# EAGLE design stepper_ctrl_v2 (EAGLE 6.5.0)
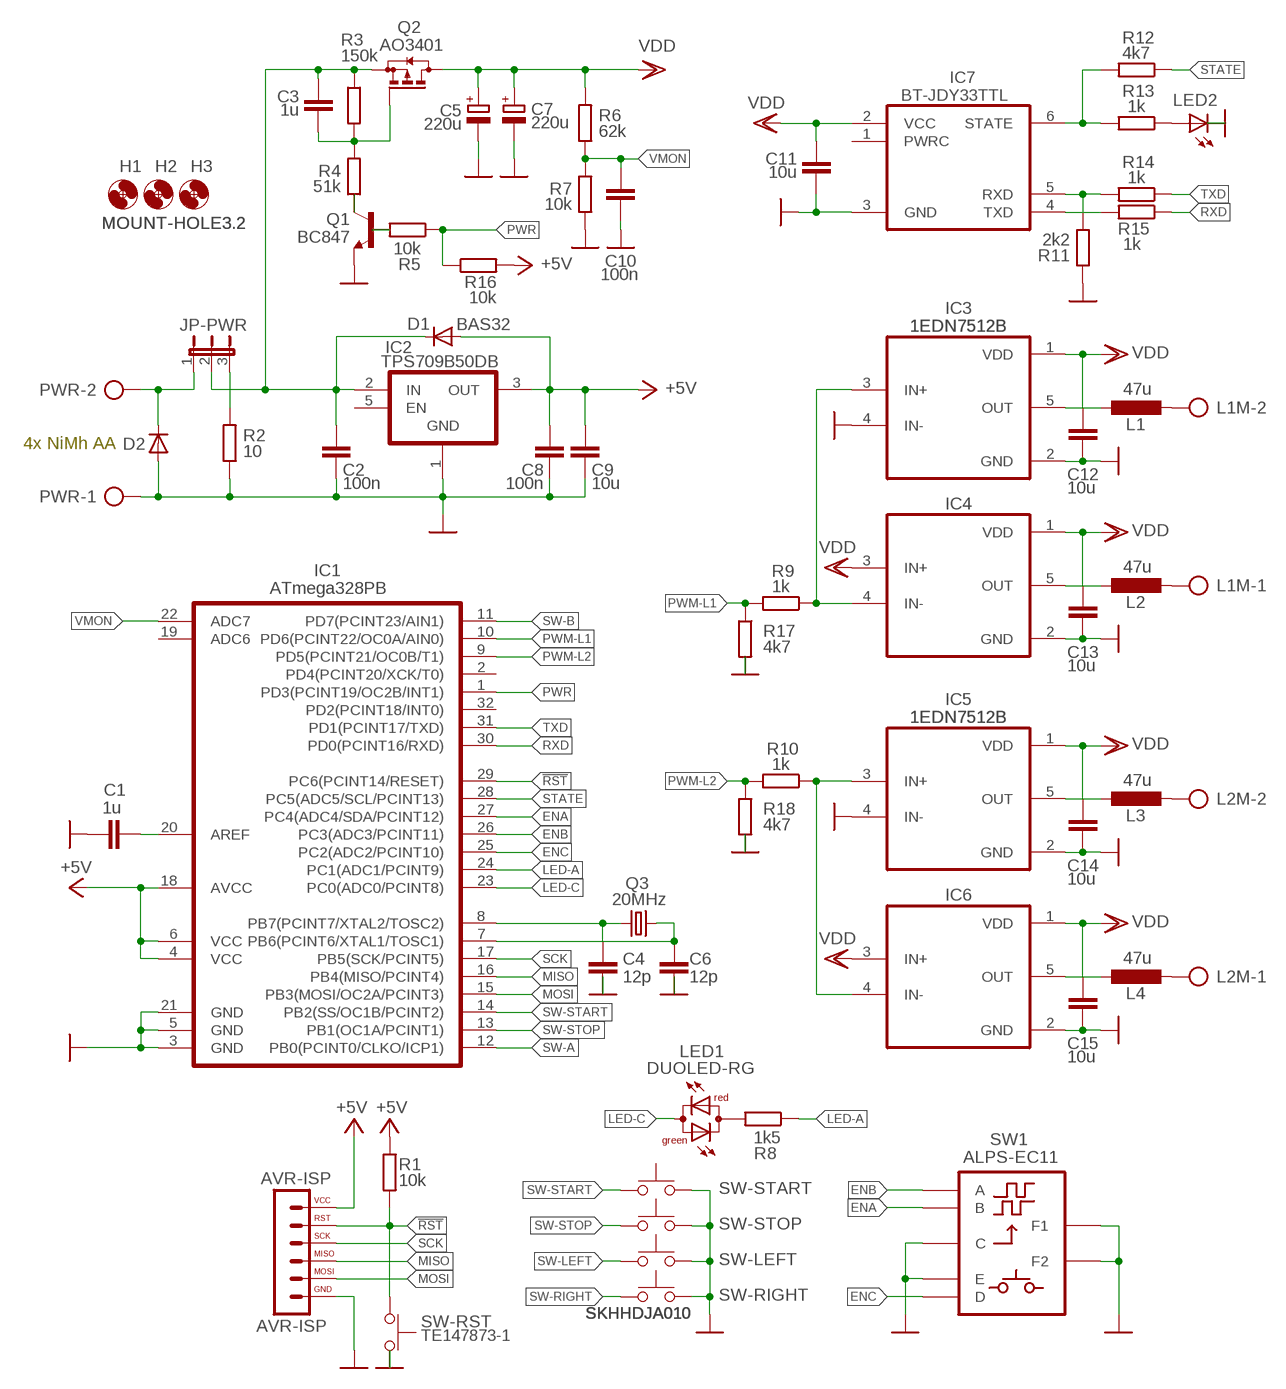
[diagram p0: schematic, sheet 1]

## Parts
AVR-ISP  AVR-ISP  AVR_SPINR  [SIL6-NNRND]
C1  1u  C-EUC0805K  [C0805K]
C2  100n  C-EUC0805K  [C0805K]
C3  1u  C-EUC0805K  [C0805K]
C4  12p  C-EUC0603K  [C0603K]
C5  220u  CPOL-EUE2.5-6  [E2,5-6]
C6  12p  C-EUC0603K  [C0603K]
C7  220u  CPOL-EUE2.5-6  [E2,5-6]
C8  100n  C-EUC0805K  [C0805K]
C9  10u  C-EUC0805K  [C0805K]
C10  100n  C-EUC0603K  [C0603K]
C11  10u  C-EUC0805K  [C0805K]
C12  10u  C-EUC0805K  [C0805K]
C13  10u  C-EUC0805K  [C0805K]
C14  10u  C-EUC0805K  [C0805K]
C15  10u  C-EUC0805K  [C0805K]
D1  BAS32  [SOD80C]
D2  DIODE-SMB  [SMB]
H1  MOUNT-HOLE3.2  [3,2]
H2  MOUNT-HOLE3.2  [3,2]
H3  MOUNT-HOLE3.2  [3,2]
IC1  ATmega328PB  ATMEGA88T  [TQFP32]
IC2  TPS709B50DB  TPS709B50DB-  [SOT23-5]
IC3  1EDN7512B  [SOT23-5]
IC4  1EDN7512B  [SOT23-5]
IC5  1EDN7512B  [SOT23-5]
IC6  1EDN7512B  [SOT23-5]
IC7  BT-JDY33TTL  [BT-JFY33TTL]
JP-PWR  JP2EB  [JP2YB]
L1  47u  L-EUL4018  [L4018]
L1M  AK500/2  [AK500/2]
L2  47u  L-EUL4018  [L4018]
L2M  AK500/2  [AK500/2]
L3  47u  L-EUL4018  [L4018]
L4  47u  L-EUL4018  [L4018]
LED1  DUOLED-RG  [LED3MM]
LED2  LED3MM  [LED3MM]
PWR  AK500/2  [AK500/2]
Q1  BC847  BC847CLT1SMD  [SOT23]
Q2  AO3401  BSS84  [SOT23]
Q3  20MHz  CRYSTALHC49U-V  [HC49U-V]
R1  10k  R-EU_R0603  [R0603]
R2  10  R-EU_R0805  [R0805]
R3  150k  R-EU_R0603  [R0603]
R4  51k  R-EU_R0603  [R0603]
R5  10k  R-EU_R0603  [R0603]
R6  62k  R-EU_R0603  [R0603]
R7  10k  R-EU_R0603  [R0603]
R8  1k5  R-EU_R0603  [R0603]
R9  1k  R-EU_R0603  [R0603]
R10  1k  R-EU_R0603  [R0603]
R11  2k2  R-EU_R0603  [R0603]
R12  4k7  R-EU_R0603  [R0603]
R13  1k  R-EU_R0603  [R0603]
R14  1k  R-EU_R0603  [R0603]
R15  1k  R-EU_R0603  [R0603]
R16  10k  R-EU_R0603  [R0603]
R17  4k7  R-EU_R0603  [R0603]
R18  4k7  R-EU_R0603  [R0603]
SW1  ALPS-EC11  ALPS_EC11  [ALPS_EC11]
SW-LEFT  SKHHDJA010  CUDL1_A  [CUDL1]
SW-RIGHT  SKHHDJA010  CUDL1_A  [CUDL1]
SW-RST  TE147873-1  CUDL1TE147873-1  [TE-147873-1]
SW-START  SKHHDJA010  CUDL1_A  [CUDL1]
SW-STOP  SKHHDJA010  CUDL1_A  [CUDL1]

## Nets
!RST [merkur]: AVR-ISP.5 IC1.29(PC6(PCINT14/RESET)) R1.2 SW-RST.P$2
+5V [merkur]: AVR-ISP.6 C8.1 C9.1 D1.A IC1.4(VCC) IC1.6(VCC) IC1.18(AVCC) IC2.3(OUT) R1.1 R16.2
ENA [merkur]: IC1.27(PC4(ADC4/SDA/PCINT12)) SW1.B
ENB [merkur]: IC1.26(PC3(ADC3/PCINT11)) SW1.A
ENC [merkur]: IC1.25(PC2(ADC2/PCINT10)) SW1.D
GND [merkur]: AVR-ISP.1 C1.1 C2.2 C4.2 C5.- C6.2 C7.- C8.2 C9.2 C10.2 C11.2 C12.2 C13.2 C14.2 C15.2 D2.A IC1.3(GND) IC1.5(GND) IC1.21(GND) IC2.1(GND) IC3.2(GND) IC3.4(IN-) IC4.2(GND) IC5.2(GND) IC5.4(IN-) IC6.2(GND) IC7.3(GND) LED2.K(C) PWR.1 Q1.2(E) R2.1 R7.1 R11.2 R17.2 R18.2 SW1.C SW1.E SW1.F1 SW1.F2 SW-LEFT.1 SW-LEFT.2 SW-RIGHT.1 SW-RIGHT.2 SW-RST.P$1 SW-START.1 SW-START.2 SW-STOP.1 SW-STOP.2
LED-A [merkur]: IC1.24(PC1(ADC1/PCINT9)) R8.1
LED-C [merkur]: IC1.23(PC0(ADC0/PCINT8)) LED1.K(C)
MISO [merkur]: AVR-ISP.3 IC1.16(PB4(MISO/PCINT4))
MOSI [merkur]: AVR-ISP.2 IC1.15(PB3(MOSI/OC2A/PCINT3))
N$1 [merkur]: IC3.3(IN+) IC4.4(IN-) R9.1
N$2 [merkur]: C1.2 IC1.20(AREF)
N$3 [merkur]: C2.1 C3.1 D1.C IC2.2(IN) JP-PWR.2 Q2.2(S) R3.1
N$4 [merkur]: D2.C JP-PWR.1 PWR.2
N$5 [merkur]: IC5.3(IN+) IC6.4(IN-) R10.1
N$6 [merkur]: JP-PWR.3 R2.2
N$7 [merkur]: LED2.A R13.1
N$8 [merkur]: IC7.6(STATE) R12.2 R13.2
N$9 [merkur]: IC7.5(RXD) R11.1 R14.2
N$10 [merkur]: IC7.4(TXD) R15.2
N$11 [merkur]: C4.1 IC1.8(PB7(PCINT7/XTAL2/TOSC2)) Q3.1
N$12 [merkur]: C6.1 IC1.7(PB6(PCINT6/XTAL1/TOSC1)) Q3.2
N$13 [merkur]: Q1.1(B) R5.2
N$14 [merkur]: LED1.A R8.2
N$15 [merkur]: IC3.5(OUT) L1.2
N$16 [merkur]: IC4.5(OUT) L2.2
N$17 [merkur]: IC5.5(OUT) L3.2
N$18 [merkur]: IC6.5(OUT) L4.2
N$19 [merkur]: L1.1 L1M.2
N$20 [merkur]: L2M.2 L3.1
N$21 [merkur]: L2M.1 L4.1
N$22 [merkur]: L1M.1 L2.1
N$37 [merkur]: C3.2 Q2.1(G) R3.2 R4.2
N$47 [merkur]: Q1.3(C) R4.1
PWM-L1 [merkur]: IC1.10(PD6(PCINT22/OC0A/AIN0)) R9.2 R17.1
PWM-L2 [merkur]: IC1.9(PD5(PCINT21/OC0B/T1)) R10.2 R18.1
PWR [merkur]: IC1.1(PD3(PCINT19/OC2B/INT1)) R5.1 R16.1
RXD [merkur]: IC1.30(PD0(PCINT16/RXD)) R15.1
SCK [merkur]: AVR-ISP.4 IC1.17(PB5(SCK/PCINT5))
STATE [merkur]: IC1.28(PC5(ADC5/SCL/PCINT13)) R12.1
SW-A [merkur]: IC1.12(PB0(PCINT0/CLKO/ICP1))
SW-B [merkur]: IC1.11(PD7(PCINT23/AIN1))
SW-LEFT [merkur]: SW-LEFT.3 SW-LEFT.4
SW-RIGHT [merkur]: SW-RIGHT.3 SW-RIGHT.4
SW-START [merkur]: IC1.14(PB2(SS/OC1B/PCINT2)) SW-START.3 SW-START.4
SW-STOP [merkur]: IC1.13(PB1(OC1A/PCINT1)) SW-STOP.3 SW-STOP.4
TXD [merkur]: IC1.31(PD1(PCINT17/TXD)) R14.1
VDD [merkur]: C5.+ C7.+ C11.1 C12.1 C13.1 C14.1 C15.1 IC3.1(VDD) IC4.1(VDD) IC4.3(IN+) IC5.1(VDD) IC6.1(VDD) IC6.3(IN+) IC7.2(VCC) Q2.3(D) R6.2
VMON [merkur]: C10.1 IC1.22(ADC7) R6.1 R7.2
Unconnected: IC1.2(PD4(PCINT20/XCK/T0)) IC1.19(ADC6) IC1.32(PD2(PCINT18/INT0)) IC2.5(EN) IC7.1(PWRC)

## Notes on the sheet
- 4x NiMh AA

## Library data of the parts
AVR-ISP = ostatni:AVR_SPI: SPI rozhranni pro muj kua programator AVR.
C1-C4 C6 C8-C15 = rcl:C-EU: CAPACITOR, European symbol
C5 C7 = rcl:CPOL-EU: POLARIZED CAPACITOR, European symbol
D1 = diode:BAS32: BAS32: High speed diode. trr = 4ns, Ur = 75V, If = 200mA.
D2 = diode:DIODE-: DIODE
H1-H3 = holes:MOUNT-HOLE: MOUNTING HOLE with drill center marker
IC1 = ostatni:ATMEGA88T
IC2 = ostatni:TPS709*: Texas, ultra low quiscent current LDO 2.7 - 30V input, ~1µA quiscent current. EN open or high to enable but EN voltage below 6.5V!. Maximum capacitance for stability is 47µF, minimum is 2.2µF. Careful to other pinout versions like 709Axx and 709Bxx!
IC3-IC6 = ostatni:1EDN7512B: FET driver 4/8A common output.
IC7 = ostatni:BT-JDY33TTL: Bluetooth module JDY33TTL: https://www.laskakit.cz/bluetooth-modul-jdy-33-ttl
JP-PWR = jumper:JP2E: JUMPER
L1-L4 = rcl:L-EU: INDUCTOR, European symbol
L1M L2M PWR = con-ptr500:AK500/2: CONNECTOR; OC_FARNELL: unknown; OC_NEWARK: unknown
LED1 = led:DUOLED-RG
LED2 = led:LED: LED OSRAM: - CHIPLED LG R971, LG N971, LY N971, LG Q971, LY Q971, LO R971, LY R971 LH N974, LH R974 LS Q976, LO Q976, LY Q976 LO Q996 - Hyper CHIPLED LW Q18S LB Q993, LB Q99A, LB R99A - SideLED LS A670, LO A670, LY A670, LG A670, LP A670 LB A673, LV A673, LT A673, LW A673 LH A674 LY A675 LS A676, LA A676, LO A676, LY A676, LW A676 LS A679, LY A679, LG A679 - Hyper Micro SIDELED® LS Y876, LA Y876, LO Y876, LY Y876 LT Y87S - SmartLED LW L88C, LW L88S LB L89C, LB L89S, LG L890 LS L89K, LO L89K, LY L89K LS L896, LA L896, LO L896, LY L896 - TOPLED LS T670, LO T670, LY T670, LG T670, LP T670 LSG T670, LSP T670, LSY T670, LOP T670, LYG T670 LG T671, LOG T671, LSG T671 LB T673, LV T673, LT T673, LW T673 LH T674 LS T676, LA T676, LO T676, LY T676, LB T676, LH T676, LSB T676, LW T676 LB T67C, LV T67C, LT T67C, LS T67K, LO T67K, LY T67K, LW E67C LS E67B, LA E67B, LO E67B, LY E67B, LB E67C, LV E67C, LT E67C LW T67C LS T679, LY T679, LG T679 LS T770, LO T770, LY T770, LG T770, LP T770 LB T773, LV T773, LT T773, LW T773 LH T774 LS E675, LA E675, LY E675, LS T675 LS T776, LA T776, LO T776, LY T776, LB T776 LHGB T686 LT T68C, LB T68C - Hyper Mini TOPLED® LB M676 - Mini TOPLED Santana® LG M470 LS M47K, LO M47K, LY M47K Source: http://www.osram.convergy.de LUXEON: - LUMILED® LXK2-PW12-R00, LXK2-PW12-S00, LXK2-PW14-U00, LXK2-PW14-V00 LXK2-PM12-R00, LXK2-PM12-S00, LXK2-PM14-U00 LXK2-PE12-Q00, LXK2-PE12-R00, LXK2-PE12-S00, LXK2-PE14-T00, LXK2-PE14-U00 LXK2-PB12-K00, LXK2-PB12-L00, LXK2-PB12-M00, LXK2-PB14-N00, LXK2-PB14-P00, LXK2-PB14-Q00 LXK2-PR12-L00, LXK2-PR12-M00, LXK2-PR14-Q00, LXK2-PR14-R00 LXK2-PD12-Q00, LXK2-PD12-R00, LXK2-PD12-S00 LXK2-PH12-R00, LXK2-PH12-S00 LXK2-PL12-P00, LXK2-PL12-Q00, LXK2-PL12-R00 Source: www.luxeon.com KINGBRIGHT: KA-3528ASYC Source: www.kingbright.com
Q1 = transistor-npn:BC847*: NPN Transistor
Q2 = transistor-small-signal:BSS84: P-CHANNEL MOS FET
Q3 = crystal:CRYSTAL: CRYSTAL; OC_FARNELL: 1666969; OC_NEWARK: unknown
R1-R18 = rcl:R-EU_: RESISTOR, European symbol
SW1 = ostatni:ALPS_EC11: ALPS EC11 encoder with axial switch notes: C is common terminal for A,B pulse outputs F1, F2 are frame solder pads
SW-LEFT SW-RIGHT SW-RST SW-START SW-STOP = butony:CUDL1

## Net classes
15 merkur: clearance 0.254 mm

## Board
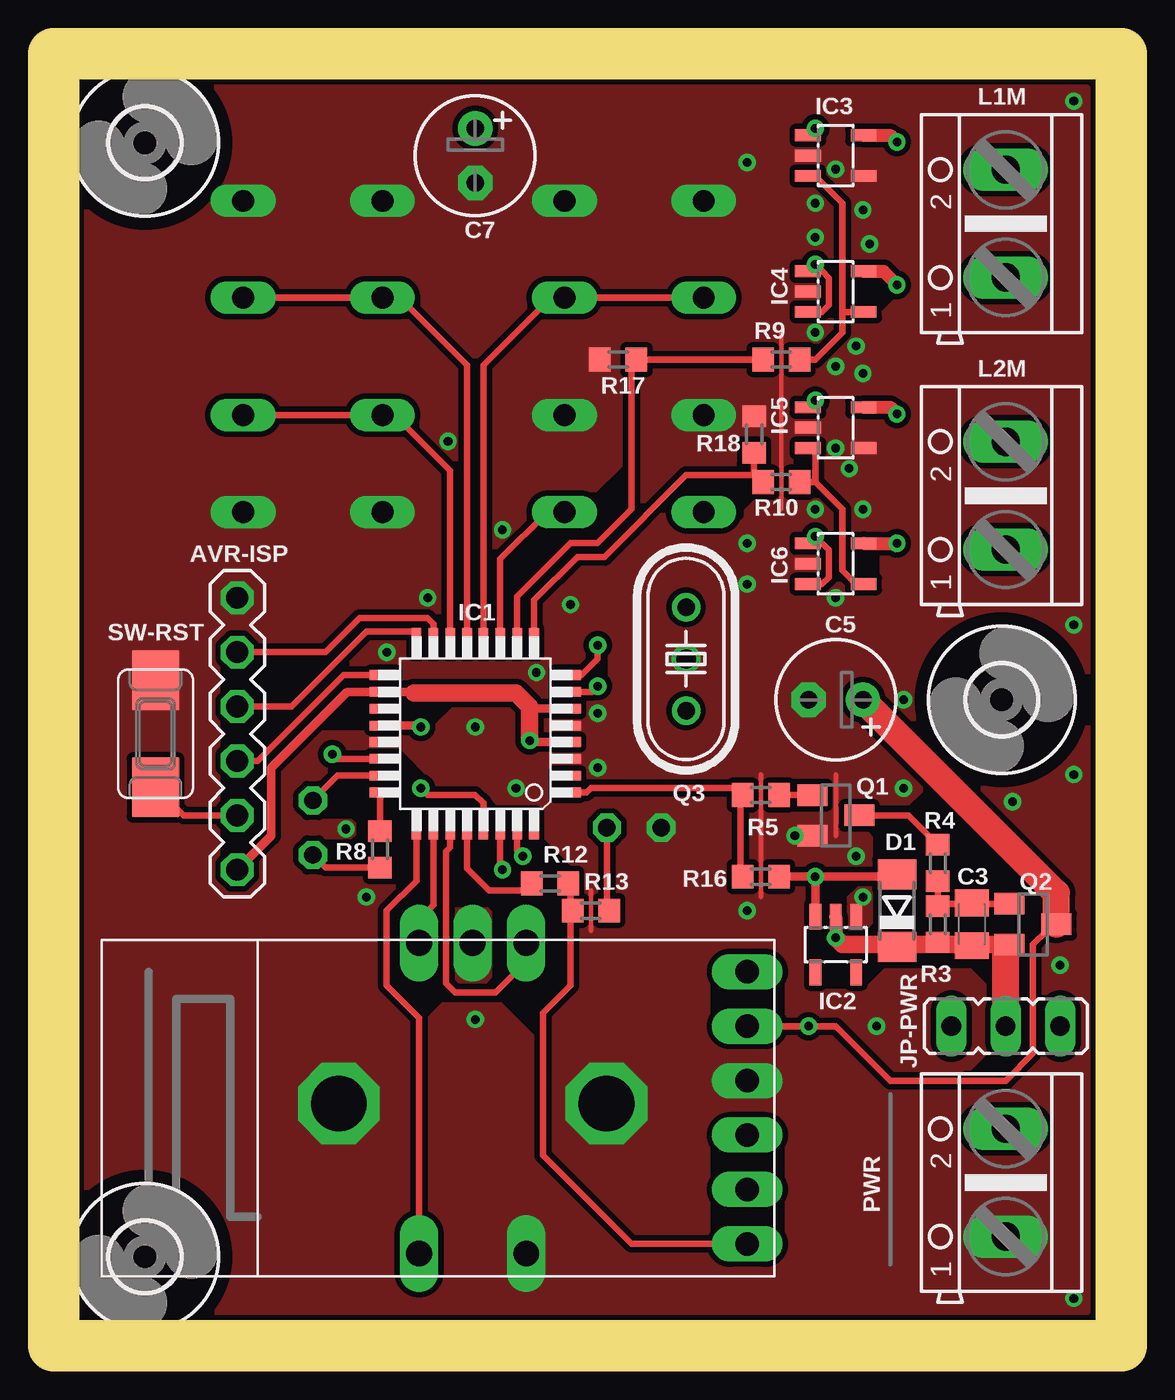
[diagram p1: board, top side]
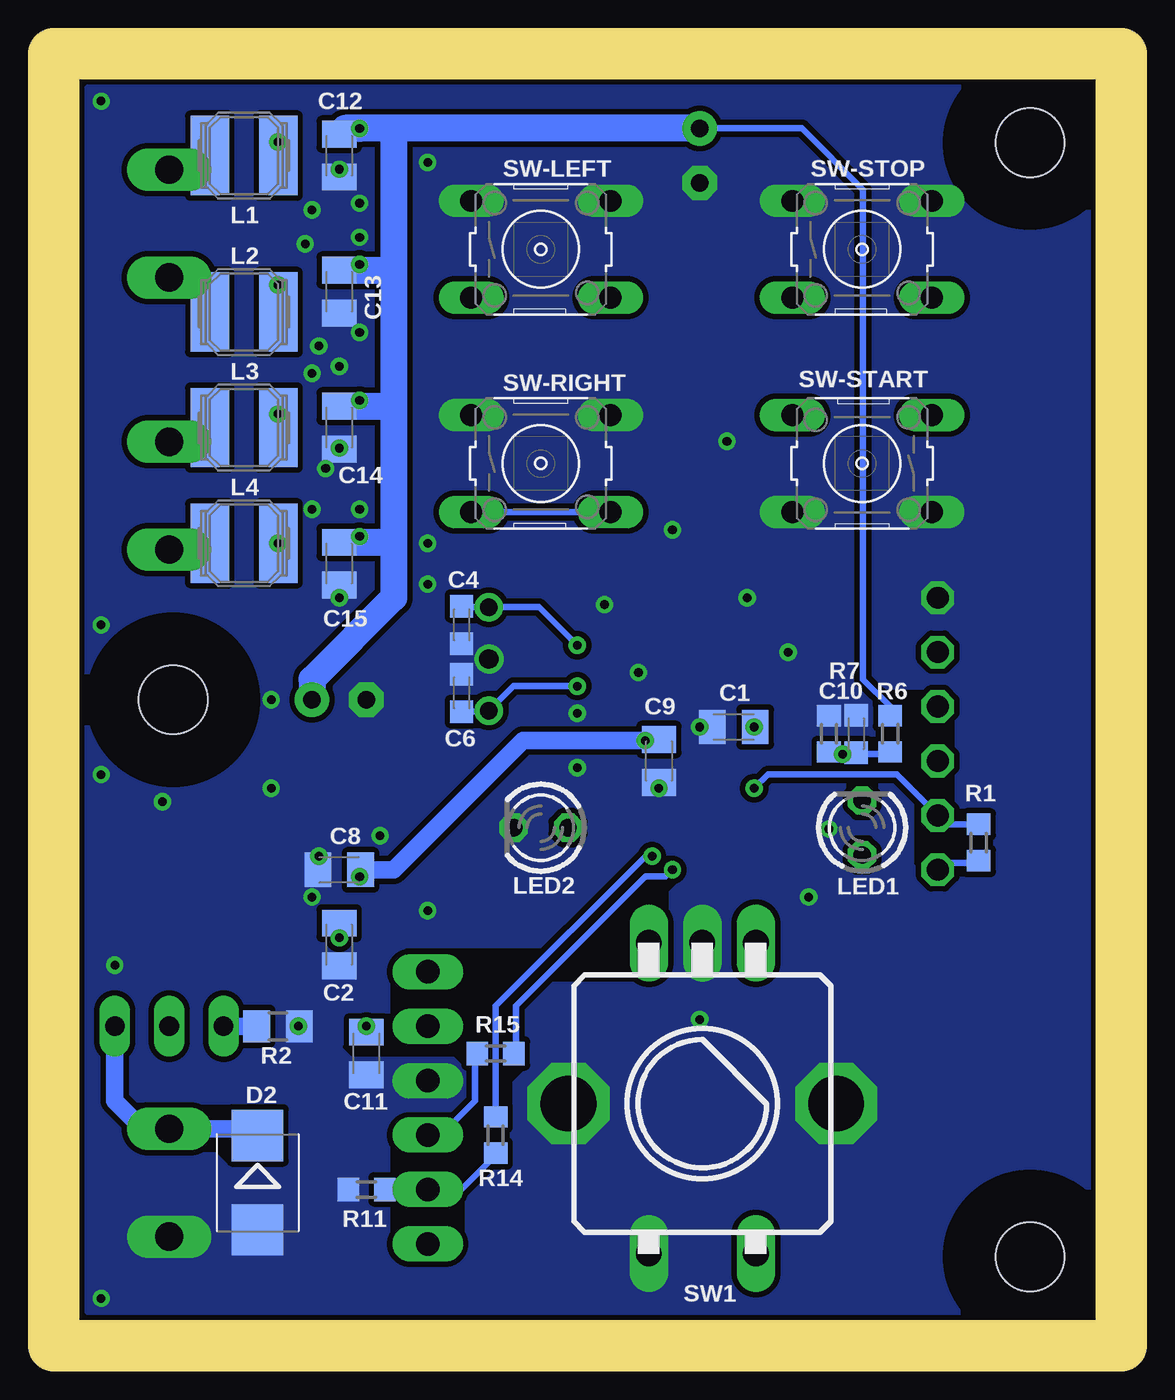
[diagram p2: board, bottom side, seen from below]

Size 49.85 x 60.33 mm. Coordinates in mm from the lower left corner, seen from the top.
Outline: 0,60.33 49.85,60.33 49.85,0 0,0 0,60.33
Copper layers (1*16): Top 0.035mm / dielectric 1.5mm / Bottom 0.035mm
Design rules "default *": minimum track width 10mil, minimum drill 24mil, track to track 8mil, track to pad 8mil, pad to pad 8mil, via to via 8mil, smd to smd 8mil, copper to edge 8mil, drill to drill 8mil, minimum pad ring 10mil, minimum via ring 8mil, stop-mask expansion 4mil, vias tented up to drill 0mil, thermal gap 10mil
tRestrict: 48 lines
bRestrict: 20 lines

### Footprints (pad centres in the part's own frame; a part is rotated, then mirrored left to right if it is on the bottom)
SIL6-NNRND = drill 1.016 octagon: 1 -6.35,0; 2 -3.81,0; 3 -1.27,0; 4 1.27,0; 5 3.81,0; 6 6.35,0
C0805K = smd 1.25 x 1.6: 1 -1,0; 2 1,0
C0603K = smd 1.05 x 1.08: 1 -0.875,0; 2 0.875,0
E2,5-6 = drill 0.813 pad 1.6: + -1.27,0 | drill 0.813 pad 1.6 octagon: - 1.27,0
SOD80C = smd 1.4 x 1.8: A 1.7,0; C -1.7,0
SMB = smd 2.4 x 2.4: A 2.2,0; C -2.2,0
3,2 = hole 3.2: 0,0
TQFP32 = smd 1.27 x 0.45: 1 -4.293,2.743; 2 -4.293,1.956; 3 -4.293,1.168; 4 -4.293,0.381; 5 -4.293,-0.381; 6 -4.293,-1.168; 7 -4.293,-1.956; 8 -4.293,-2.743; 17 4.293,-2.743; 18 4.293,-1.956; 19 4.293,-1.168; 20 4.293,-0.381; 21 4.293,0.381; 22 4.293,1.168; 23 4.293,1.956; 24 4.293,2.743 | smd 0.45 x 1.27: 9 -2.743,-4.293; 10 -1.956,-4.293; 11 -1.168,-4.293; 12 -0.381,-4.293; 13 0.381,-4.293; 14 1.168,-4.293; 15 1.956,-4.293; 16 2.743,-4.293; 25 2.743,4.293; 26 1.956,4.293; 27 1.168,4.293; 28 0.381,4.293; 29 -0.381,4.293; 30 -1.168,4.293; 31 -1.956,4.293; 32 -2.743,4.293
SOT23-5 = smd 0.55 x 1.2: 1 -0.95,-1.3; 2 0,-1.3; 3 0.95,-1.3; 4 0.95,1.3; 5 -0.95,1.3
BT-JFY33TTL = drill 1.1 long: 1 1.27,-6.35; 2 1.27,-3.81; 3 1.27,-1.27; 4 1.27,1.27; 5 1.27,3.81; 6 1.27,6.35
JP2YB = drill 0.914 long: 1 -2.54,0; 2 0,0; 3 2.54,0
L4018 = smd 1.8 x 3.7: 1 -1.6,0; 2 1.6,0
AK500/2 = drill 1.321 long: 1 -2.515,0; 2 2.515,0
LED3MM = drill 0.813 octagon: A -1.27,0; K 1.27,0
SOT23 = smd 1 x 1.4: 1 -0.95,-1.1; 2 0.95,-1.1; 3 0,1.1
HC49U-V = drill 0.813: 1 -2.413,0; 2 2.413,0
R0603 = smd 1 x 1.1: 1 -0.85,0; 2 0.85,0
R0805 = smd 1.25 x 1.5: 1 -1,0; 2 1,0
ALPS_EC11 = drill 1.2 pad 1.778 long: A -2.54,-7.62; B 2.46,-7.62; C -0.04,-7.62; D -2.54,6.88; E 2.46,6.88 | drill 2.6 pad 3.81 octagon: F1 -6.29,-0.12; F2 6.21,-0.12
CUDL1 = drill 1.016 long: 1 -3.251,2.261; 2 3.251,2.261; 3 -3.251,-2.261; 4 3.251,-2.261
TE-147873-1 = smd 2.8 x 2.2: P$1 -2.5,0; P$2 2.5,0

### Placement (x,y rotation side)
AVR-ISP  8.57,28.57 270 top
C1  18.1,28.89 0 bottom
C2  36.51,18.73 270 bottom
C3  42.86,19.69 90 top
C4  30.8,33.66 270 bottom
C5  36.51,30.16 180 top
C6  30.8,30.48 90 bottom
C7  19.68,55.56 270 top
C8  36.51,22.23 180 bottom
C9  21.59,27.3 270 bottom
C10  12.38,28.57 90 bottom
C11  35.24,13.65 270 bottom
C12  36.51,55.56 270 bottom
C13  36.51,49.21 270 bottom
C14  36.51,42.86 270 bottom
C15  36.51,36.51 270 bottom
D1  39.37,20.32 90 top
D2  40.32,7.62 270 bottom
H1  4.26,4.16 0 top
H2  4.26,56.16 0 top
H3  44.26,30.16 0 top
IC1  19.68,28.57 180 top
IC2  36.51,18.73 180 top
IC3  36.51,55.56 270 top
IC4  36.51,49.21 270 top
IC5  36.51,42.86 270 top
IC6  36.51,36.51 270 top
IC7  33.66,11.11 180 top
JP-PWR  44.45,14.92 180 top
L1  40.96,55.56 0 bottom
L1M  44.45,52.39 90 top
L2  40.96,48.26 0 bottom
L2M  44.45,39.69 90 top
L3  40.96,42.86 0 bottom
L4  40.96,37.46 0 bottom
LED1  12.1,24.19 90 bottom
LED2  27.1,24.19 180 bottom
PWR  44.45,7.62 90 top
Q1  36.51,24.77 270 top
Q2  45.72,19.69 270 top
Q3  29.53,32.07 270 top
R1  6.67,23.5 90 bottom
R2  39.37,14.92 180 bottom
R3  41.27,19.69 90 top
R4  41.27,22.54 270 top
R5  33.02,25.72 0 top
R6  10.79,28.57 90 bottom
R7  13.65,28.57 270 bottom
R8  15.24,23.18 270 top
R9  33.97,46.04 180 top
R10  33.97,40.32 180 top
R11  35.24,7.3 180 bottom
R12  23.18,21.59 0 top
R13  25.08,20.32 180 top
R14  29.21,9.84 270 bottom
R15  29.21,13.65 180 bottom
R16  33.02,21.91 0 top
R17  26.35,46.04 180 top
R18  32.7,42.54 90 top
SW1  19.6,11.19 180 bottom
SW-LEFT  27.1,51.19 0 bottom
SW-RIGHT  27.1,41.19 0 bottom
SW-RST  4.76,28.57 270 top
SW-START  12.1,41.19 180 bottom
SW-STOP  12.1,51.19 0 bottom

### Tracks (layer width: path | path; a pad name or v marks a point on that pad's centre or on a via)
!RST  (via drill 0.4)
  Top 0.305: IC1.29 20.07,25.34 19.68,25.72 17.46,25.72 v17.15,26.04 | AVR-ISP.5 6.07,24.77 SW-RST.P$2
  Bottom 0.305: v17.15,26.04 16.51,26.67 10.48,26.67 AVR-ISP.5 8.15,24.35 R1.2
+5V  (via drill 0.4)
  Top 0.406: IC2.3 35.56,21.27 v35.56,21.91 | D1.A 39.37,21.91 v35.56,21.91 | 16.83,30.48 16.78,30.53 IC1.18 13.7,30.53 10.16,26.99 10.16,23.81 AVR-ISP.6 | IC1.6 22.44,29.74 22.22,29.53 | IC1.4 22.29,28.19 v22.22,28.26 | R16.2 v35.56,21.91
  Top 0.813: 16.83,30.48 21.59,30.48 22.22,29.85 22.22,29.53 v22.22,28.26
  Bottom 0.305: R1.1 6.77,22.54 7.94,22.54 8.25,22.23 AVR-ISP.6
  Bottom 0.406: v35.56,21.91 35.56,21.86 C8.1
  Bottom 0.813: C9.1 21.64,28.26 v22.22,28.26 27.94,28.26 33.97,22.23 C8.1
ENA
  Top 0.305: SW1.B 22.06,17.94 20.64,16.51 18.73,16.51 18.32,16.92 18.32,23.09 18.52,23.28 IC1.27
ENB
  Top 0.305: IC1.26 17.73,20.59 17.15,20 17.15,18.89 SW1.A
ENC
  Top 0.305: IC1.25 16.94,21.7 15.56,20.32 15.56,16.83 17.06,15.32 SW1.D
GND  (via drill 0.4, 0.9)
  Top 0.2: 25.08,21.27 25.08,19.37 | 33.02,26.67 33.02,20.96 | 36.51,26.67 36.51,23.81 | 33.97,47.31 33.97,39.05
  other vias: 36.51,34.92 36.51,41.91 36.51,54.93 35.56,47.31 22.54,31.43 19.68,28.89 25.4,29.53 25.4,26.99 21.59,26.04 39.69,26.04 44.77,25.4 37.78,20.96 37.46,22.86 38.42,14.92 36.51,45.72 35.56,53.34 35.56,39.05 34.61,23.81 46.99,17.78 13.65,24.13 15.56,32.38 39.69,30.16 18.41,42.23 19.68,15.24 38.1,51.43 37.78,39.05 47.62,58.1 47.62,2.22 32.38,20.32 47.62,33.66 47.62,26.67 35.56,51.75 37.46,46.67 37.78,53.02 32.38,55.24 37.78,45.4 37.15,40.96 29.53,32.07 32.38,37.46 32.38,35.56 20.95,38.1 17.46,34.92 24.13,34.61 14.61,20.96
  pour Bottom (no thermals): 1.27,58.74 48.26,58.74 48.26,1.59 1.27,1.59
  pour Top (no thermals): 1.27,58.74 48.26,58.74 48.26,1.59 1.27,1.59
LED-A
  Top 0.305: IC1.24 15.35,25.83 15.24,25.72 R8.1
LED-C
  Top 0.305: IC1.23 13.26,26.62 LED1.K
MISO
  Top 0.305: IC1.16 16.94,33.22 16.83,33.34 14.61,33.34 11.11,29.85 AVR-ISP.3
MOSI
  Top 0.305: IC1.15 17.73,33.71 17.46,33.97 14.29,33.97 12.7,32.38 AVR-ISP.2
N$1
  Top 0.305: IC3.3 35.56,54.61 36.83,53.34 36.83,48.26 | 36.83,48.26 IC4.4 | 36.83,48.26 36.83,47.31 35.56,46.04 R9.1
N$2  (via drill 0.4)
  Top 0.406: IC1.20 17.08,28.96 v17.15,28.89
  Bottom 0.406: v17.15,28.89 C1.2
N$3  (via drill 0.4)
  Top 0.61: IC2.2 v36.51,19.05
  Top 0.813: 44.45,18.57 Q2.2 42.91,18.74 C3.1 42.86,18.73 41.38,18.73 R3.1 41.27,18.73 39.48,18.73 D1.C 39.37,18.73 36.83,18.73 v36.51,19.05
  Top 1.27: JP-PWR.2 44.45,18.57
  Bottom 0.813: v36.51,19.05 C2.1
N$4
  Bottom 0.813: JP-PWR.1 46.99,11.43 45.69,10.13 PWR.2 40.64,10.13 D2.C
N$5
  Top 0.305: IC5.3 35.56,41.91 35.56,40.32 | 35.56,40.32 R10.1 | IC6.4 37.46,35.56 36.83,36.2 36.83,39.05 35.56,40.32
N$6
  Bottom 0.813: JP-PWR.3 R2.2
N$7
  Top 0.305: LED2.A 25.83,20.42 R13.1
N$8
  Top 0.305: IC7.6 26.99,4.76 22.86,8.89 22.86,15.56 24.13,16.83 24.13,20.32 | 24.13,20.32 24.13,21.49 R12.2 | R13.2 24.13,20.32
N$9
  Bottom 0.305: R14.2 29.21,8.89 30.8,7.3 IC7.5 R11.1
N$10
  Bottom 0.305: R15.2 30.06,13.44 30.16,13.33 30.16,11.43 31.75,9.84 IC7.4
N$11  (via drill 0.4)
  Top 0.305: IC1.8 24.65,31.32 25.4,32.07 v25.4,32.7
  Bottom 0.305: v25.4,32.7 27.18,34.48 Q3.1 30.75,34.48 C4.1
N$12  (via drill 0.4)
  Top 0.305: IC1.7 25.13,30.53 v25.4,30.8
  Bottom 0.305: v25.4,30.8 28.38,30.8 Q3.2 29.58,29.61 C6.1
N$13
  Top 0.305: R5.2 Q1.1
N$14
  Top 0.305: R8.2 12.7,22.33 LED1.A
N$15  (via drill 0.4)
  Top 0.61: IC3.5 39.06,56.51 v39.37,56.2
  Bottom 0.61: v39.37,56.2 39.37,55.57 L1.2
N$16  (via drill 0.4)
  Top 0.61: IC4.5 38.74,50.16 v39.37,49.53
  Bottom 0.61: v39.37,49.53 39.69,48.27 L2.2
N$17  (via drill 0.4)
  Top 0.61: IC5.5 39.06,43.81 v39.37,43.5
  Bottom 0.61: v39.37,43.5 39.37,42.88 L3.2
N$18  (via drill 0.4)
  Top 0.61: IC6.5 v39.37,37.46
  Bottom 0.61: v39.37,37.46 L4.2
N$19
  Bottom 0.305: L1M.2 43.22,54.9 L1.1
N$20
  Bottom 0.305: L2M.2 43.22,42.2 L3.1
N$21
  Bottom 0.61: L2M.1 42.85,37.17 L4.1
N$22
  Bottom 0.61: L1M.1 43.52,49.87 42.86,49.21 42.86,48.27 L2.1
N$37
  Top 0.305: Q2.1 42.86,20.64 | C3.2 42.86,20.64 | 42.86,20.64 41.27,20.64 R3.2 R4.2
N$47
  Top 0.305: Q1.3 39.9,24.77 R4.1
PWM-L1
  Top 0.305: R9.2 R17.1 26.99,46.04 26.99,39.05 25.4,37.46 24.13,37.46 21.64,34.98 IC1.10
PWM-L2
  Top 0.305: R10.2 33.02,40.32 32.7,40.64 | 32.7,40.64 29.53,40.64 25.72,36.83 24.45,36.83 22.43,34.81 IC1.9 | R18.1 32.7,40.64
PWR
  Top 0.305: IC1.1 24.88,25.83 25.08,26.04 31.75,26.04 31.95,25.83 32.06,25.83 R5.1 32.07,25.72 32.07,22.01 R16.1
RXD  (via drill 0.4)
  Top 0.305: IC1.30 20.85,22.33 v20.95,22.23
  Bottom 0.305: v20.95,22.23 21.27,21.91 22.22,21.91 28.26,15.87 28.26,13.65 R15.1
SCK
  Top 0.305: IC1.17 13.54,31.32 9.52,27.3 AVR-ISP.4
STATE
  Top 0.305: IC1.28 19.3,22.29 20.32,21.27 22.01,21.27 R12.1
SW-A
  Top 0.305: IC1.12 20.07,45.78 23.21,48.93
SW-B
  Top 0.305: IC1.11 20.85,36.73 23.05,38.93
SW-LEFT
  Top 0.305: SW-LEFT.4 SW-LEFT.3
SW-RIGHT
  Bottom 0.305: SW-RIGHT.4 SW-RIGHT.3
SW-START
  Top 0.305: IC1.14 18.52,40.86 15.88,43.5 15.4,43.5 SW-START.4 SW-START.3
SW-STOP
  Top 0.305: IC1.13 19.3,45.78 16.19,48.89 15.39,48.89 SW-STOP.3 SW-STOP.4
TXD  (via drill 0.4)
  Top 0.305: IC1.31 21.64,23.13 v21.91,22.86
  Bottom 0.305: R14.1 29.21,15.87 22.22,22.86 v21.91,22.86
VDD  (via drill 0.4)
  Top 0.305: Q2.3 46.5,19.37 46.35,19.37 45.72,18.73 45.72,13.65 44.45,12.38 39.05,12.38 36.51,14.92 v35.24,14.92 IC7.2 | IC6.1 35.88,37.46 36.2,37.15 36.2,35.88 35.88,35.56 IC6.3 | IC4.1 35.88,50.16 36.2,49.85 36.2,48.58 35.88,48.26 IC4.3
  Top 0.406: IC3.1 35.56,56.51 v35.56,56.83 | IC4.1 35.56,50.16 v35.56,50.48 | IC5.1 35.56,43.81 v35.56,44.13 | IC6.1 35.56,37.46 v35.56,37.78
  Top 1.27: Q2.3 46.82,21.12 C5.+
  Bottom 0.305: R6.2 10.79,29.85 12.06,31.11 12.06,53.97 14.92,56.83 C7.+ | C11.1 v35.24,14.92
  Bottom 0.406: v35.56,50.48 36.2,50.53 C13.1 | v35.56,44.13 36.2,44.18 C14.1 | v35.56,37.78 36.2,37.83 C15.1
  Bottom 1.27: C7.+ 33.97,56.83 | 33.97,56.83 v35.56,56.83 36.24,56.83 C12.1 | 33.97,56.83 33.97,50.16 | 33.97,50.16 33.97,43.81 | 33.97,43.81 33.97,37.46 | C15.1 34.02,37.51 33.97,37.46 | C14.1 34.02,43.86 33.97,43.81 | C13.1 34.02,50.21 33.97,50.16 | 33.97,37.46 33.97,34.92 37.78,31.11 C5.+
VMON  (via drill 0.4)
  Top 0.305: IC1.22 13.23,27.41 v13.02,27.62
  Bottom 0.305: R7.2 13.12,27.73 v13.02,27.62 12.46,27.62 C10.1 12.38,27.62 10.9,27.62 R6.1

### Text on the board
tDocu: STOP | LEFT | µ-step driver / V1.1, 2024-12-30 / (c) Stanislav Maslan | START | RIGHT | GND | 16 | 9 | MOSI | 17 | 8 | MISO | SCK | 1 | 24 | RST | 32 | 25 | +5V | OFF | ON | VDD | GND | TXD | BAT+ | RXD | STAT | BAT-
bDocu: C | A | C | A